# EAGLE design USBtoATAPI (EAGLE 9.4.2)
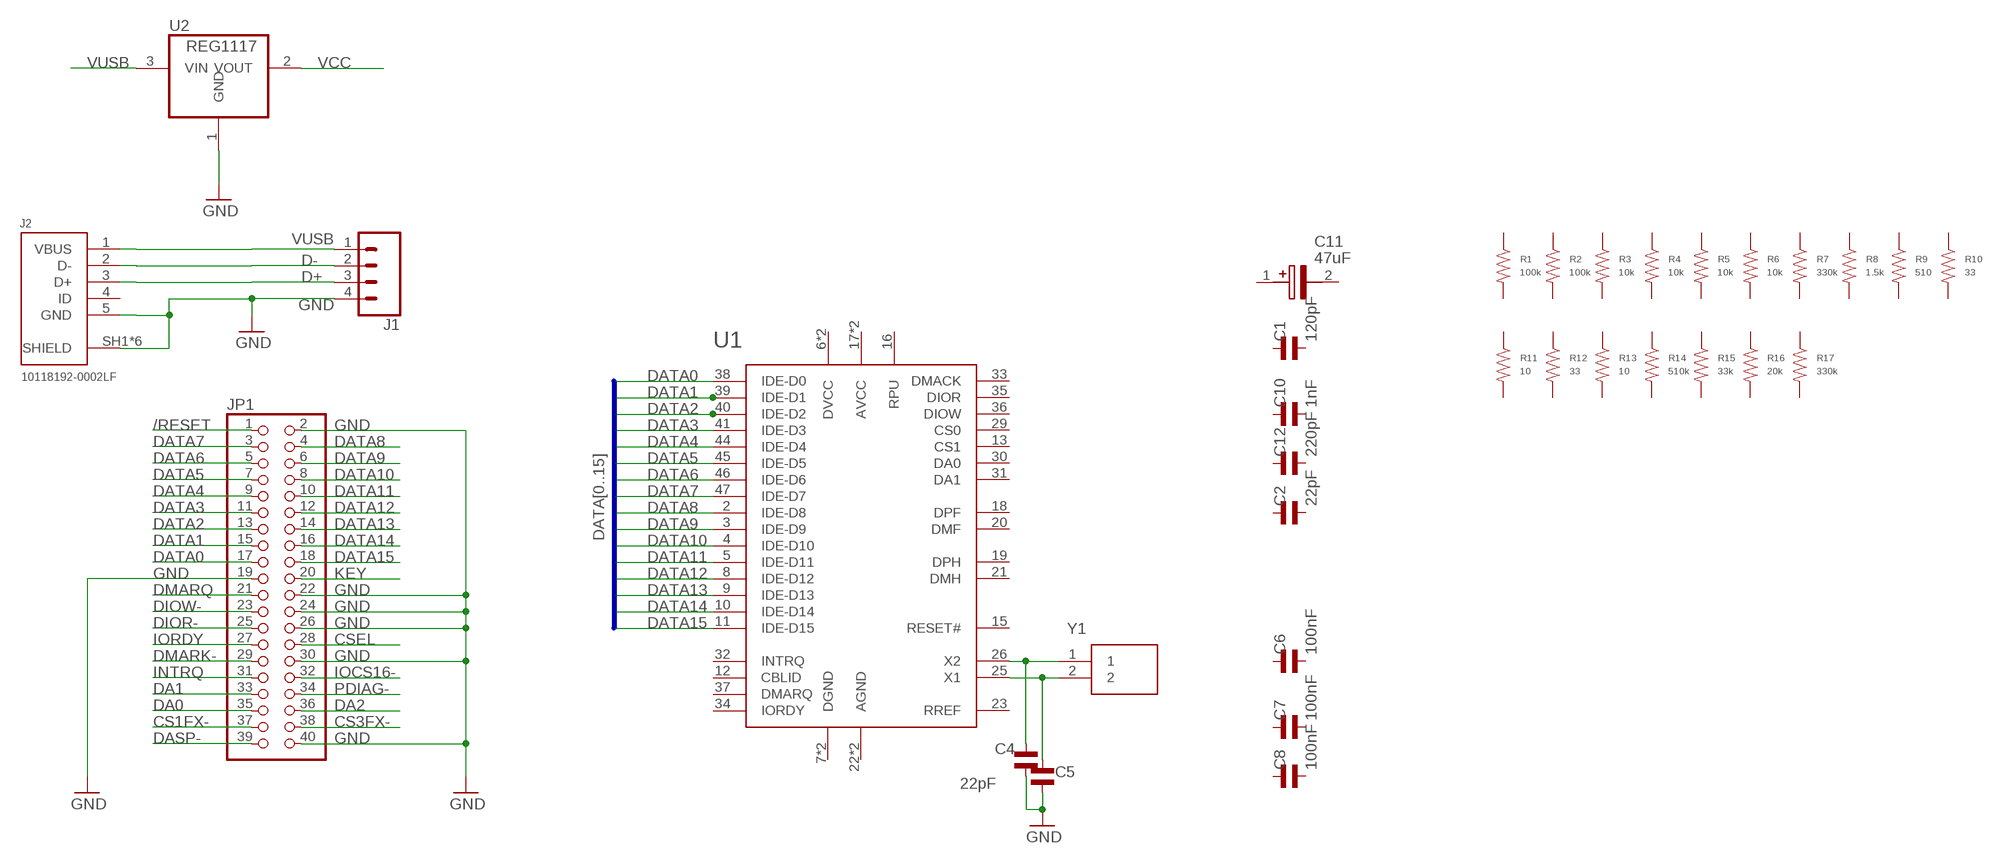
[diagram p0: schematic, sheet 1]

## Parts
C1  120pF  CAPACITOR_NP_0805  [C0805]
C2  22pF  CAPACITOR_NP_0805  [C0805]
C4  22pF  CAPACITOR_NP_0805  [C0805]
C5  22pF  CAPACITOR_NP_0805  [C0805]
C6  100nF  CAPACITOR_NP_0805  [C0805]
C7  100nF  CAPACITOR_NP_0805  [C0805]
C8  100nF  CAPACITOR_NP_0805  [C0805]
C10  1nF  CAPACITOR_NP_0805  [C0805]
C11  47uF  UWR0J470MCL1GB  [CAPAE430X550N]
C12  220pF  CAPACITOR_NP_0805  [C0805]
J1  CONN_04JST-PTH-VERT  [JST-4-PTH-VERT]
J2  10118192-0002LF  [10118192-0002LF]
JP1  PINHD-2X20  [2X20]
R1  100k  RESISTOR_0805  [R0805]
R2  100k  RESISTOR_0805  [R0805]
R3  10k  RESISTOR_0805  [R0805]
R4  10k  RESISTOR_0805  [R0805]
R5  10k  RESISTOR_0805  [R0805]
R6  10k  RESISTOR_0805  [R0805]
R7  330k  RESISTOR_0805  [R0805]
R8  1.5k  RESISTOR_0805  [R0805]
R9  510  RESISTOR_0805  [R0805]
R10  33  RESISTOR_0805  [R0805]
R11  10  RESISTOR_0805  [R0805]
R12  33  RESISTOR_0805  [R0805]
R13  10  RESISTOR_0805  [R0805]
R14  510k  RESISTOR_0805  [R0805]
R15  33k  RESISTOR_0805  [R0805]
R16  20k  RESISTOR_0805  [R0805]
R17  330k  RESISTOR_0805  [R0805]
U1  GL811E  [LQFP-48]
U2  REG1117  [SOT223]
Y1  445C33C12M00000  [445C33C12M00000]

## Nets
/RESET: JP1.1
CS1FX-: JP1.37
CS3FX-: JP1.38
CSEL: JP1.28
D+: J1.3 J2.3(D+)
D-: J1.2 J2.2(D-)
DA0: JP1.35
DA1: JP1.33
DA2: JP1.36
DASP-: JP1.39
DATA0: JP1.17 U1.38(IDE-D0) U1.39(IDE-D1)
DATA1: JP1.15 U1.40(IDE-D2)
DATA2: JP1.13
DATA3: JP1.11 U1.41(IDE-D3)
DATA4: JP1.9 U1.44(IDE-D4)
DATA5: JP1.7 U1.45(IDE-D5)
DATA6: JP1.5 U1.46(IDE-D6)
DATA7: JP1.3 U1.47(IDE-D7)
DATA8: JP1.4 U1.2(IDE-D8)
DATA9: JP1.6 U1.3(IDE-D9)
DATA10: JP1.8 U1.4(IDE-D10)
DATA11: JP1.10 U1.5(IDE-D11)
DATA12: JP1.12 U1.8(IDE-D12)
DATA13: JP1.14 U1.9(IDE-D13)
DATA14: JP1.16 U1.10(IDE-D14)
DATA15: JP1.18 U1.11(IDE-D15)
DIOR-: JP1.25
DIOW-: JP1.23
DMARK-: JP1.29
DMARQ: JP1.21
GND: C4.P$2 C5.P$1 J1.4 J2.5(GND) J2.SH1(SHIELD) J2.SH2(SHIELD) J2.SH3(SHIELD) J2.SH4(SHIELD) J2.SH5(SHIELD) J2.SH6(SHIELD) JP1.2 JP1.19 JP1.22 JP1.24 JP1.26 JP1.30 JP1.40 U2.1(GND)
INTRQ: JP1.31
IOCS16-: JP1.32
IORDY: JP1.27
KEY: JP1.20
N$1: C4.P$1 U1.26(X2) Y1.1
N$2: C5.P$2 U1.25(X1) Y1.2
PDIAG-: JP1.34
VCC: U2.2(VOUT)
VUSB: J1.1 J2.1(VBUS) U2.3(VIN)
Unconnected: C1.P$1 C1.P$2 C2.P$1 C2.P$2 C6.P$1 C6.P$2 C7.P$1 C7.P$2 C8.P$1 C8.P$2 C10.P$1 C10.P$2 C11.1(+) C11.2(-) C12.P$1 C12.P$2 J2.4(ID) R1.P$1 R1.P$2 R2.P$1 R2.P$2 R3.P$1 R3.P$2 R4.P$1 R4.P$2 R5.P$1 R5.P$2 R6.P$1 R6.P$2 R7.P$1 R7.P$2 R8.P$1 R8.P$2 R9.P$1 R9.P$2 R10.P$1 R10.P$2 R11.P$1 R11.P$2 R12.P$1 R12.P$2 R13.P$1 R13.P$2 R14.P$1 R14.P$2 R15.P$1 R15.P$2 R16.P$1 R16.P$2 R17.P$1 R17.P$2 U1.6(DVCC) U1.7(DGND) U1.12(CBLID) U1.13(CS1) U1.15(RESET#) U1.16(RPU) U1.17(AVCC) U1.18(DPF) U1.19(DPH) U1.20(DMF) U1.21(DMH) U1.22(AGND) U1.23(RREF) U1.24(AVCC) U1.27(AGND) U1.29(CS0) U1.30(DA0) U1.31(DA1) U1.32(INTRQ) U1.33(DMACK) U1.34(IORDY) U1.35(DIOR) U1.36(DIOW) U1.37(DMARQ) U1.42(DGND) U1.43(DVCC)

## Buses
DATA[0..15]

## Library data of the parts
C1 C2 C4-C8 C10 C12 = MF_Passives:CAPACITOR_NP: Library: MF_Passives Description: Device for Non-Polarized Capacitors. Manufacture part number (MPN) can be added via Attributes. Check https://factory.macrofab.com/parts for the house parts list.; POPULATE: 1
C11 = SamacSys_Parts:UWR0J470MCL1GB: Aluminum Electrolytic Capacitors - SMD Source: Datasheet <https://componentsearchengine.com/Datasheets/1/UWR0J470MCL1GB.pdf>; DESCRIPTION: Aluminum Electrolytic Capacitors - SMD; HEIGHT: 5.5mm; MANUFACTURER_NAME: Nichicon; MANUFACTURER_PART_NUMBER: UWR0J470MCL1GB; MOUSER_PART_NUMBER: 647-UWR0J470MCL1GB; MOUSER_PRICE-STOCK: https://www.mouser.com/Search/Refine.aspx?Keyword=647-UWR0J470MCL1GB
J1 = SparkFun-Connectors:CONN_04: Multi connection point. Often used as Generic Header-pin footprint for 0.1 inch spaced/style header connections On any of the 0.1 inch spaced packages, you can populate with these: Break Away Headers - Straight <https://www.sparkfun.com/products/116> (PRT-00116) Break Away Male Headers - Right Angle <https://www.sparkfun.com/products/553> (PRT-00553) Female Headers <https://www.sparkfun.com/products/115> (PRT-00115) Break Away Headers - Machine Pin <https://www.sparkfun.com/products/117> (PRT-00117) Break Away Female Headers - Swiss Machine Pin <https://www.sparkfun.com/products/743> (PRT-00743) For SCREWTERMINALS and SPRING TERMINALS visit here: Screw Terimnals on SparkFun.com <https://www.sparkfun.com/search/results?term=Screw+Terminals> (5mm/3.5mm/2.54mm spacing) This device is also useful as a general connection point to wire up your design to another part of your project. Our various solder wires solder well into these plated through hole pads. Hook-Up Wire - Assortment (Stranded, 22 AWG) <https://www.sparkfun.com/products/11375> (PRT-11375) Hook-Up Wire - Assortment (Solid Core, 22 AWG) <https://www.sparkfun.com/products/11367> (PRT-11367) View the entire wire category on our website here <https://www.sparkfun.com/categories/141> Special notes: Molex polarized connector foot print use with SKU : PRT-08231 with associated crimp pins and housings. 1MM SMD Version SKU: PRT-10208; PROD_ID: CONN-13251
J2 = USB connector:10118192-0002LF: CONN RCPT USB2.0 MICRO B SMD R/A Manufacturer's datasheet <https://www.amphenol-icc.com/media/wysiwyg/files/drawing/10118192.pdf>; CREATED_BY: PCBLayout.com; DIGIKEY_PARTNO: 609-5379-2-ND; MANUFACTURER: Amphenol ICC (FCI); MPN: 10118192-0002LF
JP1 = adafruit:PINHD-2X20: PIN HEADER
R1-R17 = MF_Passives:RESISTOR: Library: MF_Passives Description: Device for Resistors. Manufacture part number (MPN), Voltage, Tolerance, and Wattage Rating can be added via Attributes. Check https://factory.macrofab.com/parts for the house parts list.; POPULATE: 1
U1 = GenesisLogic:GL811E
U2 = burr-brown:REG1117: 800mA and 1A Low Dropout (LDO) Positive Regulator 1.8V, 2.5V, 2.85V, 3.3V, 5V, and Adj; MPN: REG1117; OC_FARNELL: 1097566; OC_NEWARK: 14P6981
Y1 = SamacSys_Parts:445C33C12M00000: Crystals 12MHz +/-30ppm 16pF -20C +70C Source: Datasheet <https://componentsearchengine.com/Datasheets/1/445C33C12M00000.pdf>; DESCRIPTION: Crystals 12MHz +/-30ppm 16pF -20C +70C; HEIGHT: 1.35mm; MANUFACTURER_NAME: CTS; MANUFACTURER_PART_NUMBER: 445C33C12M00000; MOUSER_PART_NUMBER: 774-445C33C12M00000; MOUSER_PRICE-STOCK: https://www.mouser.com/Search/Refine.aspx?Keyword=774-445C33C12M00000

## Board
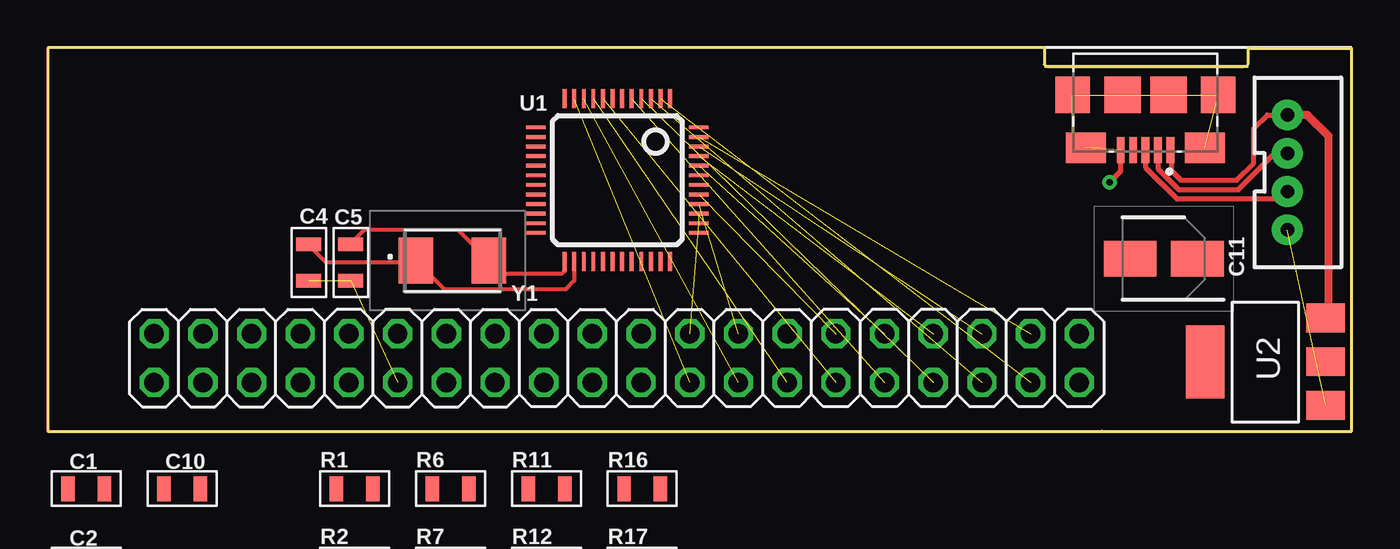
[diagram p1: board, top side]
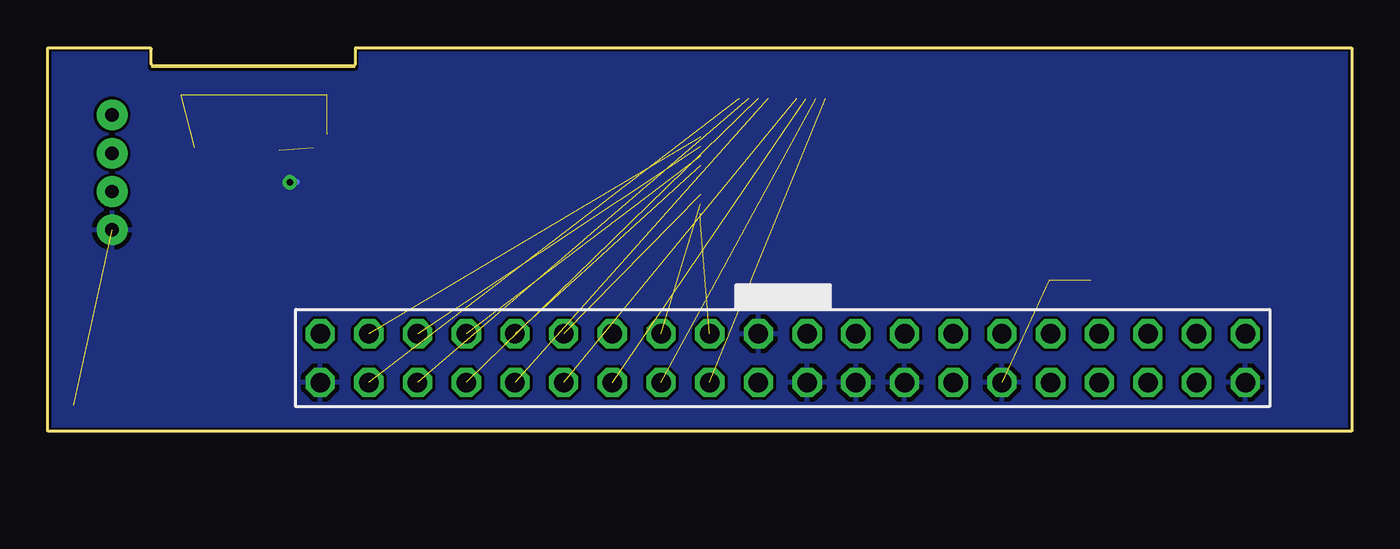
[diagram p2: board, bottom side, seen from below]

Size 68 x 20 mm. Coordinates in mm from the lower left corner, seen from the top.
Outline: 0,0 0,20 52,20 52,19 62.6,19 62.6,20 68,20 68,0 0,0
Copper layers (1*16): Top 0.035mm / dielectric 1.5mm / Bottom 0.035mm
Design rules "default *": minimum track width 6mil, minimum drill 0.35mm, track to track 6mil, track to pad 6mil, pad to pad 6mil, via to via 6mil, smd to smd 6mil, copper to edge 6mil, drill to drill 6mil, minimum pad ring 10mil, minimum via ring 8mil, stop-mask expansion 4mil, vias tented up to drill 0mil, thermal gap 10mil
Milling: 11 lines

### Footprints (pad centres in the part's own frame; a part is rotated, then mirrored left to right if it is on the bottom)
C0805 = smd 0.7 x 1.3: P$1 -0.95,0; P$2 0.95,0
CAPAE430X550N = smd 2.75 x 1.85: 1 -1.75,0; 2 1.75,0
JST-4-PTH-VERT = drill 0.7 pad 1.6: 1 -3,-0.55; 2 -1,-0.55; 3 1,-0.55; 4 3,-0.55
10118192-0002LF = smd 0.4 x 1.35: 1 -1.3,2.875; 2 -0.65,2.875; 3 0,2.875; 4 0.65,2.875; 5 1.3,2.875 | smd 2.1 x 1.6: SH1 -3.1,2.75; SH2 3.1,2.75 | smd 1.8 x 1.9: SH3 -3.8,0; SH4 3.8,0 | smd 1.9 x 1.9: SH5 -1.2,0; SH6 1.2,0
2X20 = drill 1.016 octagon: 1 -24.13,-1.27; 2 -24.13,1.27; 3 -21.59,-1.27; 4 -21.59,1.27; 5 -19.05,-1.27; 6 -19.05,1.27; 7 -16.51,-1.27; 8 -16.51,1.27; 9 -13.97,-1.27; 10 -13.97,1.27; 11 -11.43,-1.27; 12 -11.43,1.27; 13 -8.89,-1.27; 14 -8.89,1.27; 15 -6.35,-1.27; 16 -6.35,1.27; 17 -3.81,-1.27; 18 -3.81,1.27; 19 -1.27,-1.27; 20 -1.27,1.27; 21 1.27,-1.27; 22 1.27,1.27; 23 3.81,-1.27; 24 3.81,1.27; 25 6.35,-1.27; 26 6.35,1.27; 27 8.89,-1.27; 28 8.89,1.27; 29 11.43,-1.27; 30 11.43,1.27; 31 13.97,-1.27; 32 13.97,1.27; 33 16.51,-1.27; 34 16.51,1.27; 35 19.05,-1.27; 36 19.05,1.27; 37 21.59,-1.27; 38 21.59,1.27; 39 24.13,-1.27; 40 24.13,1.27
R0805 = smd 0.7 x 1.3: P$1 -0.95,0; P$2 0.95,0
LQFP-48 = smd 0.2 x 1: 1 -2.75,-4.25; 2 -2.25,-4.25; 3 -1.75,-4.25; 4 -1.25,-4.25; 5 -0.75,-4.25; 6 -0.25,-4.25; 7 0.25,-4.25; 8 0.75,-4.25; 9 1.25,-4.25; 10 1.75,-4.25; 11 2.25,-4.25; 12 2.75,-4.25; 25 2.75,4.25; 26 2.25,4.25; 27 1.75,4.25; 28 1.25,4.25; 29 0.75,4.25; 30 0.25,4.25; 31 -0.25,4.25; 32 -0.75,4.25; 33 -1.25,4.25; 34 -1.75,4.25; 35 -2.25,4.25; 36 -2.75,4.25 | smd 1 x 0.2: 13 4.25,-2.75; 14 4.25,-2.25; 15 4.25,-1.75; 16 4.25,-1.25; 17 4.25,-0.75; 18 4.25,-0.25; 19 4.25,0.25; 20 4.25,0.75; 21 4.25,1.25; 22 4.25,1.75; 23 4.25,2.25; 24 4.25,2.75; 37 -4.25,2.75; 38 -4.25,2.25; 39 -4.25,1.75; 40 -4.25,1.25; 41 -4.25,0.75; 42 -4.25,0.25; 43 -4.25,-0.25; 44 -4.25,-0.75; 45 -4.25,-1.25; 46 -4.25,-1.75; 47 -4.25,-2.25; 48 -4.25,-2.75
SOT223 = smd 1.499 x 2.007: 1 -2.261,-3.15; 2 0.025,-3.15; 3 2.311,-3.15 | smd 3.81 x 2.007: 4 0,3.15
445C33C12M00000 = smd 1.8 x 2.4: 1 -1.9,0; 2 1.9,0

### Placement (x,y rotation side)
C1  2,-3 0 top
C2  2,-7 0 top  (outside the outline)
C4  13.6,8.8 270 top
C5  15.8,8.8 90 top
C6  2,-11 0 top  (outside the outline)
C7  2,-15 0 top  (outside the outline)
C8  2,-19 0 top  (outside the outline)
C10  7,-3 0 top
C11  58.2,9 180 top
C12  7,-11 0 top  (outside the outline)
J1  65.2,13.5 270 top
J2  57.25,17.54 180 top
JP1  29.67,3.81 180 top
R1  16,-3 0 top
R2  16,-7 0 top  (outside the outline)
R3  16,-11 0 top  (outside the outline)
R4  16,-15 0 top  (outside the outline)
R5  16,-19 0 top  (outside the outline)
R6  21,-3 0 top
R7  21,-7 0 top  (outside the outline)
R8  21,-11 0 top  (outside the outline)
R9  21,-15 0 top  (outside the outline)
R10  21,-19 0 top  (outside the outline)
R11  26,-3 0 top
R12  26,-7 0 top  (outside the outline)
R13  26,-11 0 top  (outside the outline)
R14  26,-15 0 top  (outside the outline)
R15  26,-19 0 top  (outside the outline)
R16  31,-3 0 top
R17  31,-7 0 top  (outside the outline)
U1  29.7,13.1 180 top
U2  63.5,3.6 90 top
Y1  21.1,8.9 0 top

### Tracks (layer width: path | path; a pad name or v marks a point on that pad's centre or on a via)
D+
  Top 0.254: J2.3 57.25,13.75 58.9,12.1 64.25,12.1 J1.3
D-
  Top 0.254: J2.2 57.9,13.7 59,12.6 62.1,12.6 64,14.5 J1.2
DATA0  (2 unrouted)
DATA1  (1 unrouted)
DATA3  (1 unrouted)
DATA4  (1 unrouted)
DATA5  (1 unrouted)
DATA6  (1 unrouted)
DATA7  (1 unrouted)
DATA8  (1 unrouted)
DATA9  (1 unrouted)
DATA10  (1 unrouted)
DATA11  (1 unrouted)
DATA12  (1 unrouted)
DATA13  (1 unrouted)
DATA14  (1 unrouted)
DATA15  (1 unrouted)
GND  (via drill 0.35)  (9 unrouted)
  Top 0.254: J2.SH2 53.45,15.49 | J2.5 55.95,13.55 v55.37,12.98
  Bottom 0.254: v55.37,12.98 55.02,12.98 55,13
  pour Bottom: 0,20 68,20 68,0 0,0
N$1
  Top 0.203: U1.26 27.45,7.85 27,7.4 20.7,7.4 Y1.1 19.1,8.8 14.5,8.8 13.6,9.7 C4.P$1
N$2
  Top 0.203: U1.25 26.95,8.35 26.8,8.2 23.3,8.2 23,8.5 Y1.2 21.4,10.5 16.5,10.5 15.8,9.8 C5.P$2
VUSB
  Top 0.254: J2.1 58.6,14.61 58.6,13.6 59.1,13.1 62,13.1 62.9,14 62.9,15.8 63.6,16.5 J1.1
  Top 0.406: J1.1 65.7,16.5 66.8,15.4 66.8,6.06 U2.3